# EAGLE design Sensor (EAGLE 7.2.0)
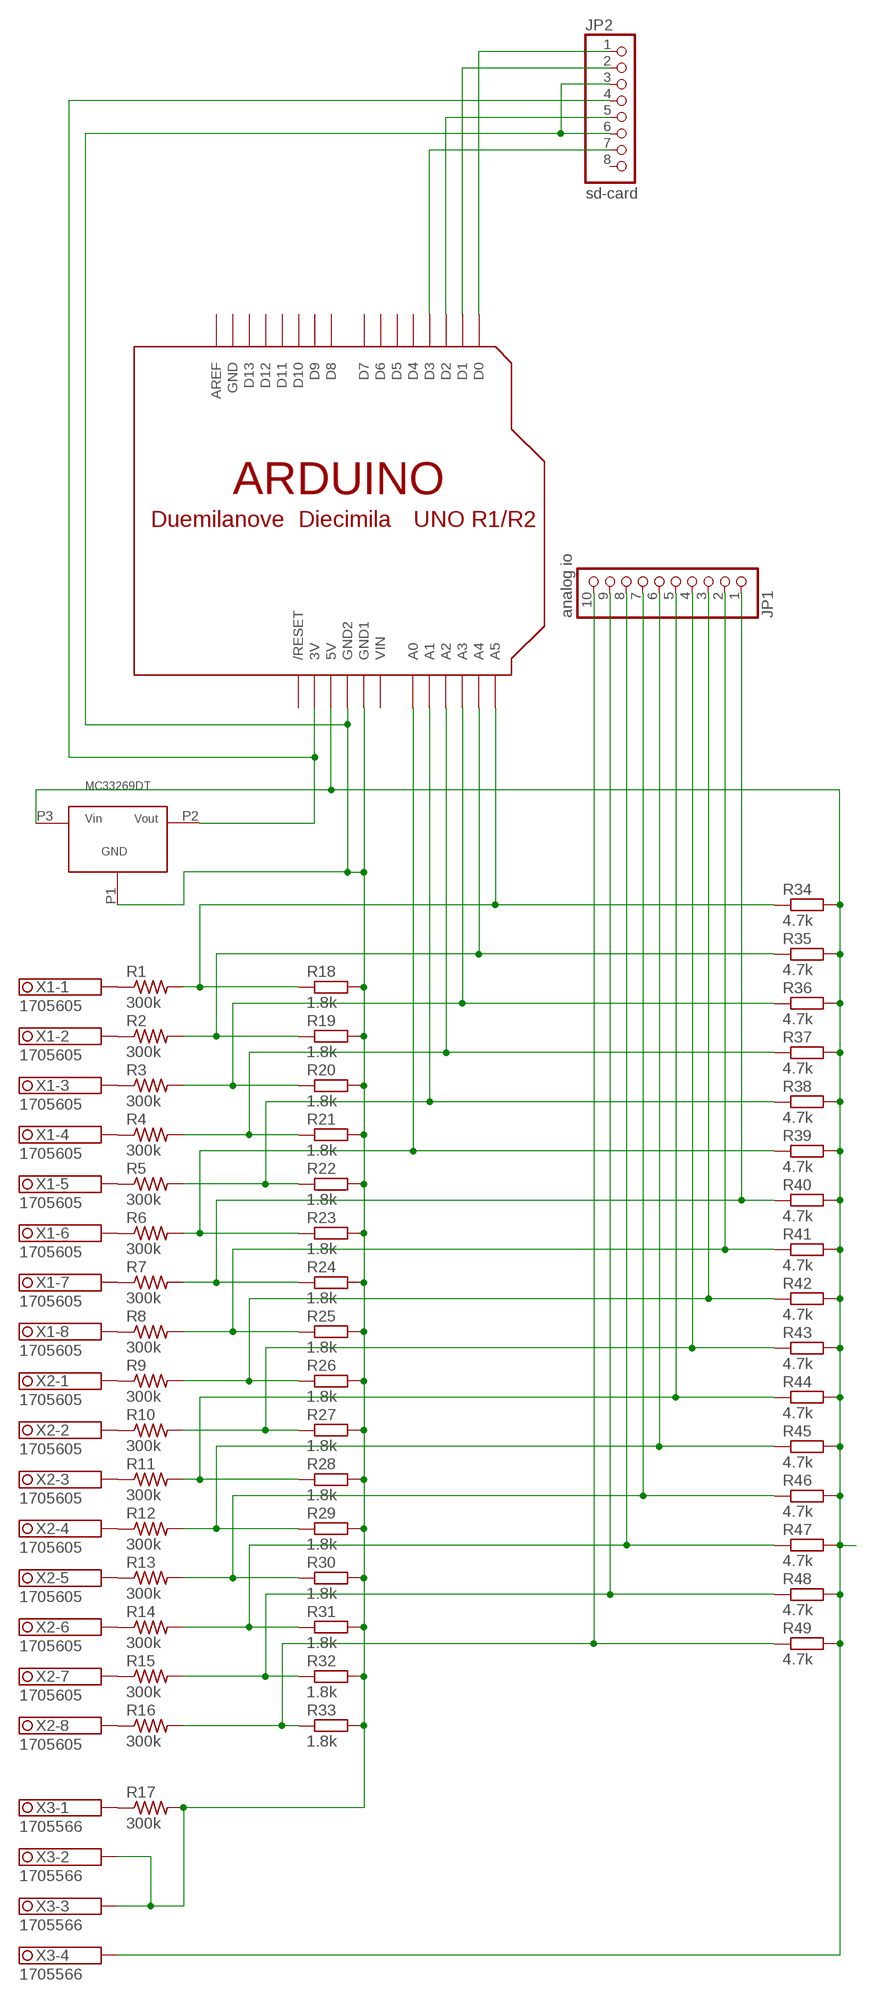
[diagram p0: schematic, sheet 1]

## Parts
JP1  analog io  PINHD-1X10  [1X10]
JP2  sd-card  PINHD-1X8  [1X08]
R1  300k  R-US_0207/15  [0207/15]
R2  300k  R-US_0207/15  [0207/15]
R3  300k  R-US_0207/15  [0207/15]
R4  300k  R-US_0207/15  [0207/15]
R5  300k  R-US_0207/15  [0207/15]
R6  300k  R-US_0207/15  [0207/15]
R7  300k  R-US_0207/15  [0207/15]
R8  300k  R-US_0207/15  [0207/15]
R9  300k  R-US_0207/15  [0207/15]
R10  300k  R-US_0207/15  [0207/15]
R11  300k  R-US_0207/15  [0207/15]
R12  300k  R-US_0207/15  [0207/15]
R13  300k  R-US_0207/15  [0207/15]
R14  300k  R-US_0207/15  [0207/15]
R15  300k  R-US_0207/15  [0207/15]
R16  300k  R-US_0207/15  [0207/15]
R17  300k  R-US_0207/15  [0207/15]
R18  1.8k  R-EU_R1206  [R1206]
R19  1.8k  R-EU_R1206  [R1206]
R20  1.8k  R-EU_R1206  [R1206]
R21  1.8k  R-EU_R1206  [R1206]
R22  1.8k  R-EU_R1206  [R1206]
R23  1.8k  R-EU_R1206  [R1206]
R24  1.8k  R-EU_R1206  [R1206]
R25  1.8k  R-EU_R1206  [R1206]
R26  1.8k  R-EU_R1206  [R1206]
R27  1.8k  R-EU_R1206  [R1206]
R28  1.8k  R-EU_R1206  [R1206]
R29  1.8k  R-EU_R1206  [R1206]
R30  1.8k  R-EU_R1206  [R1206]
R31  1.8k  R-EU_R1206  [R1206]
R32  1.8k  R-EU_R1206  [R1206]
R33  1.8k  R-EU_R1206  [R1206]
R34  4.7k  R-EU_R1206  [R1206]
R35  4.7k  R-EU_R1206  [R1206]
R36  4.7k  R-EU_R1206  [R1206]
R37  4.7k  R-EU_R1206  [R1206]
R38  4.7k  R-EU_R1206  [R1206]
R39  4.7k  R-EU_R1206  [R1206]
R40  4.7k  R-EU_R1206  [R1206]
R41  4.7k  R-EU_R1206  [R1206]
R42  4.7k  R-EU_R1206  [R1206]
R43  4.7k  R-EU_R1206  [R1206]
R44  4.7k  R-EU_R1206  [R1206]
R45  4.7k  R-EU_R1206  [R1206]
R46  4.7k  R-EU_R1206  [R1206]
R47  4.7k  R-EU_R1206  [R1206]
R48  4.7k  R-EU_R1206  [R1206]
R49  4.7k  R-EU_R1206  [R1206]
U$1  MC33269DT  [MC33269DT]
U$2  ARDUINOUNO  [ARDUINO]
X1  1705605  [1705605]
X2  1705605  [1705605]
X3  1705566  [1705566]

## Nets
N$1: R1.1 X1.1.1 X1.1.2
N$2: R2.1 X1.2.1 X1.2.2
N$3: R3.1 X1.3.1 X1.3.2
N$4: R4.1 X1.4.1 X1.4.2
N$5: R5.1 X1.5.1 X1.5.2
N$6: R6.1 X1.6.1 X1.6.2
N$7: R7.1 X1.7.1 X1.7.2
N$8: R8.1 X1.8.1 X1.8.2
N$9: R9.1 X2.1.1 X2.1.2
N$10: R10.1 X2.2.1 X2.2.2
N$11: R11.1 X2.3.1 X2.3.2
N$12: R12.1 X2.4.1 X2.4.2
N$13: R13.1 X2.5.1 X2.5.2
N$14: R14.1 X2.6.1 X2.6.2
N$15: R15.1 X2.7.1 X2.7.2
N$16: R16.1 X2.8.1 X2.8.2
N$17: R17.1 X3.1.1 X3.1.2
N$18: R1.2 R18.1 R34.1 U$2.A5
N$19: R2.2 R19.1 R35.1 U$2.A4
N$20: R3.2 R20.1 R36.1 U$2.A3
N$21: R4.2 R21.1 R37.1 U$2.A2
N$22: R5.2 R22.1 R38.1 U$2.A1
N$23: R6.2 R23.1 R39.1 U$2.A0
N$24: JP1.1 R7.2 R24.1 R40.1
N$25: JP1.2 R8.2 R25.1 R41.1
N$26: JP1.3 R9.2 R26.1 R42.1
N$27: JP1.4 R10.2 R27.1 R43.1
N$28: JP1.5 R11.2 R28.1 R44.1
N$29: JP1.6 R12.2 R29.1 R45.1
N$30: JP1.7 R13.2 R30.1 R46.1
N$31: JP1.8 R14.2 R31.1 R47.1
N$32: JP1.9 R15.2 R32.1 R48.1
N$33: JP1.10 R16.2 R33.1 R49.1
N$35: R34.2 R35.2 R36.2 R37.2 R38.2 R39.2 R40.2 R41.2 R42.2 R43.2 R44.2 R45.2 R46.2 R47.2 R48.2 R49.2 U$1.P3(VIN) U$2.5V X3.4.1 X3.4.2
N$36: JP2.1 U$2.D0
N$37: JP2.2 U$2.D1
N$38: JP2.5 U$2.D2
N$39: JP2.7 U$2.D3
N$40: JP2.4 U$1.P2(VOUT) U$2.3V
N$41: JP2.3 JP2.6 R17.2 R18.2 R19.2 R20.2 R21.2 R22.2 R23.2 R24.2 R25.2 R26.2 R27.2 R28.2 R29.2 R30.2 R31.2 R32.2 R33.2 U$1.P1(GND) U$2.GND1 U$2.GND2 X3.2.1 X3.2.2 X3.3.1 X3.3.2
Unconnected: JP2.8 U$2.AREF U$2.D4 U$2.D5 U$2.D6 U$2.D7 U$2.D8 U$2.D9 U$2.D10 U$2.D11 U$2.D12 U$2.D13 U$2.RESET(/RESET)

## Power pins joined to a net without a drawn wire
GND: U$2.GND
VIN: U$2.VIN

## Library data of the parts
JP1 = pinhead:PINHD-1X10: PIN HEADER
JP2 = pinhead:PINHD-1X8: PIN HEADER
R1-R17 = resistor:R-US_: RESISTOR, American symbol
R18-R49 = resistor:R-EU_: RESISTOR, European symbol
U$1 = mc33269dt:MC33269DT
U$2 = adafruit:ARDUINO: Arduino Diecimila/Duemilanove Make a shield with ease, this package has all the named pins as well as the two mounting drill holes and an outline of the USB and DC power connector. The outline is on the DIMENSION layer, so if your board house uses it they will cut the outline to match. http://www.ladyada.net/library/pcb/eaglelibrary.html
X1 X2 = con-phoenix-3.81:1705605: MKDSD 1,5/10-3,81 Printklemme Nennstrom: 8 A Bemessungsspannung: 200 V Raster: 3,81 mm Polzahl: 12 Montageart: Löten Anschlussart: Schraubanschluss Anschlussrichtung vom Leiter zur Platine: 0° Source: http://eshop.phoenixcontact.com .. 1705605.pdf; OC_FARNELL: unknown; OC_NEWARK: unknown
X3 = con-phoenix-3.81:1705566: MKDSD 1,5/ 4-3,81 Printklemme Nennstrom: 8 A Bemessungsspannung: 200 V Raster: 3,81 mm Polzahl: 4 Montageart: Löten Anschlussart: Schraubanschluss Anschlussrichtung vom Leiter zur Platine: 0° Source: http://eshop.phoenixcontact.com .. 1705566.pdf; OC_FARNELL: unknown; OC_NEWARK: unknown

## Net classes
0 default: width 2.032 mm, clearance 0.205 mm

## Board
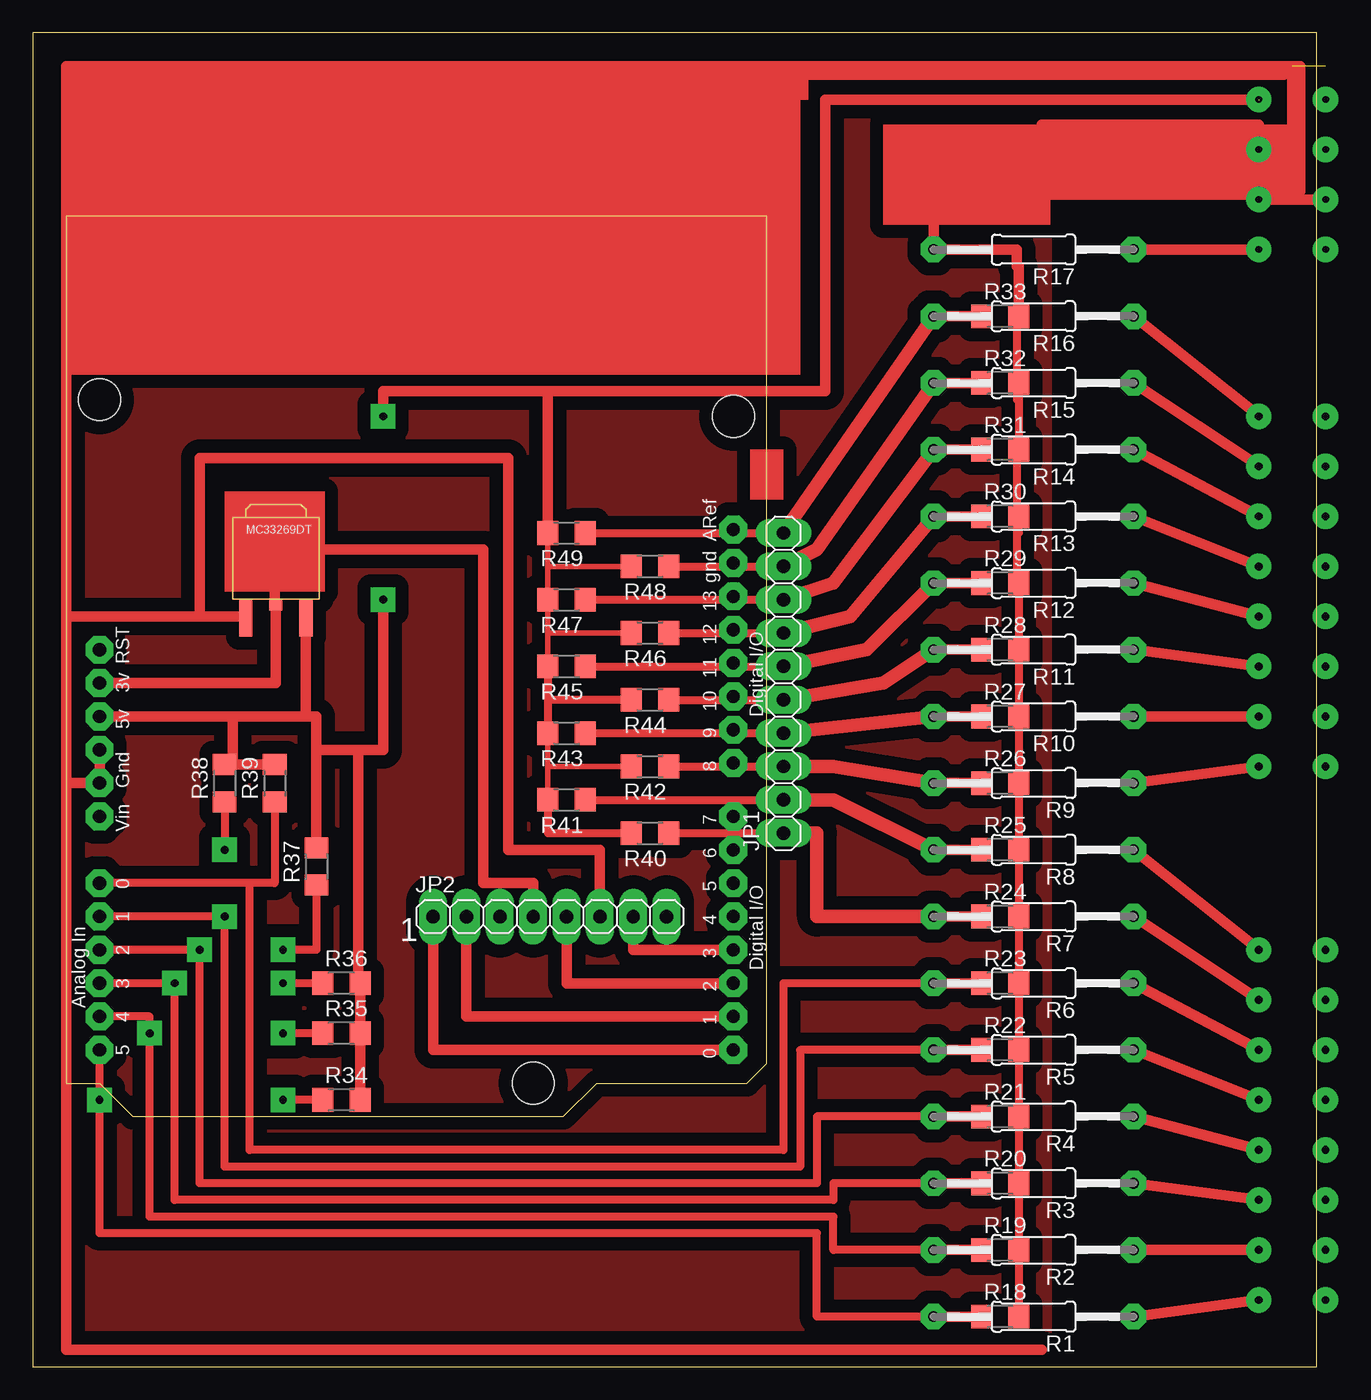
[diagram p1: board, top side]
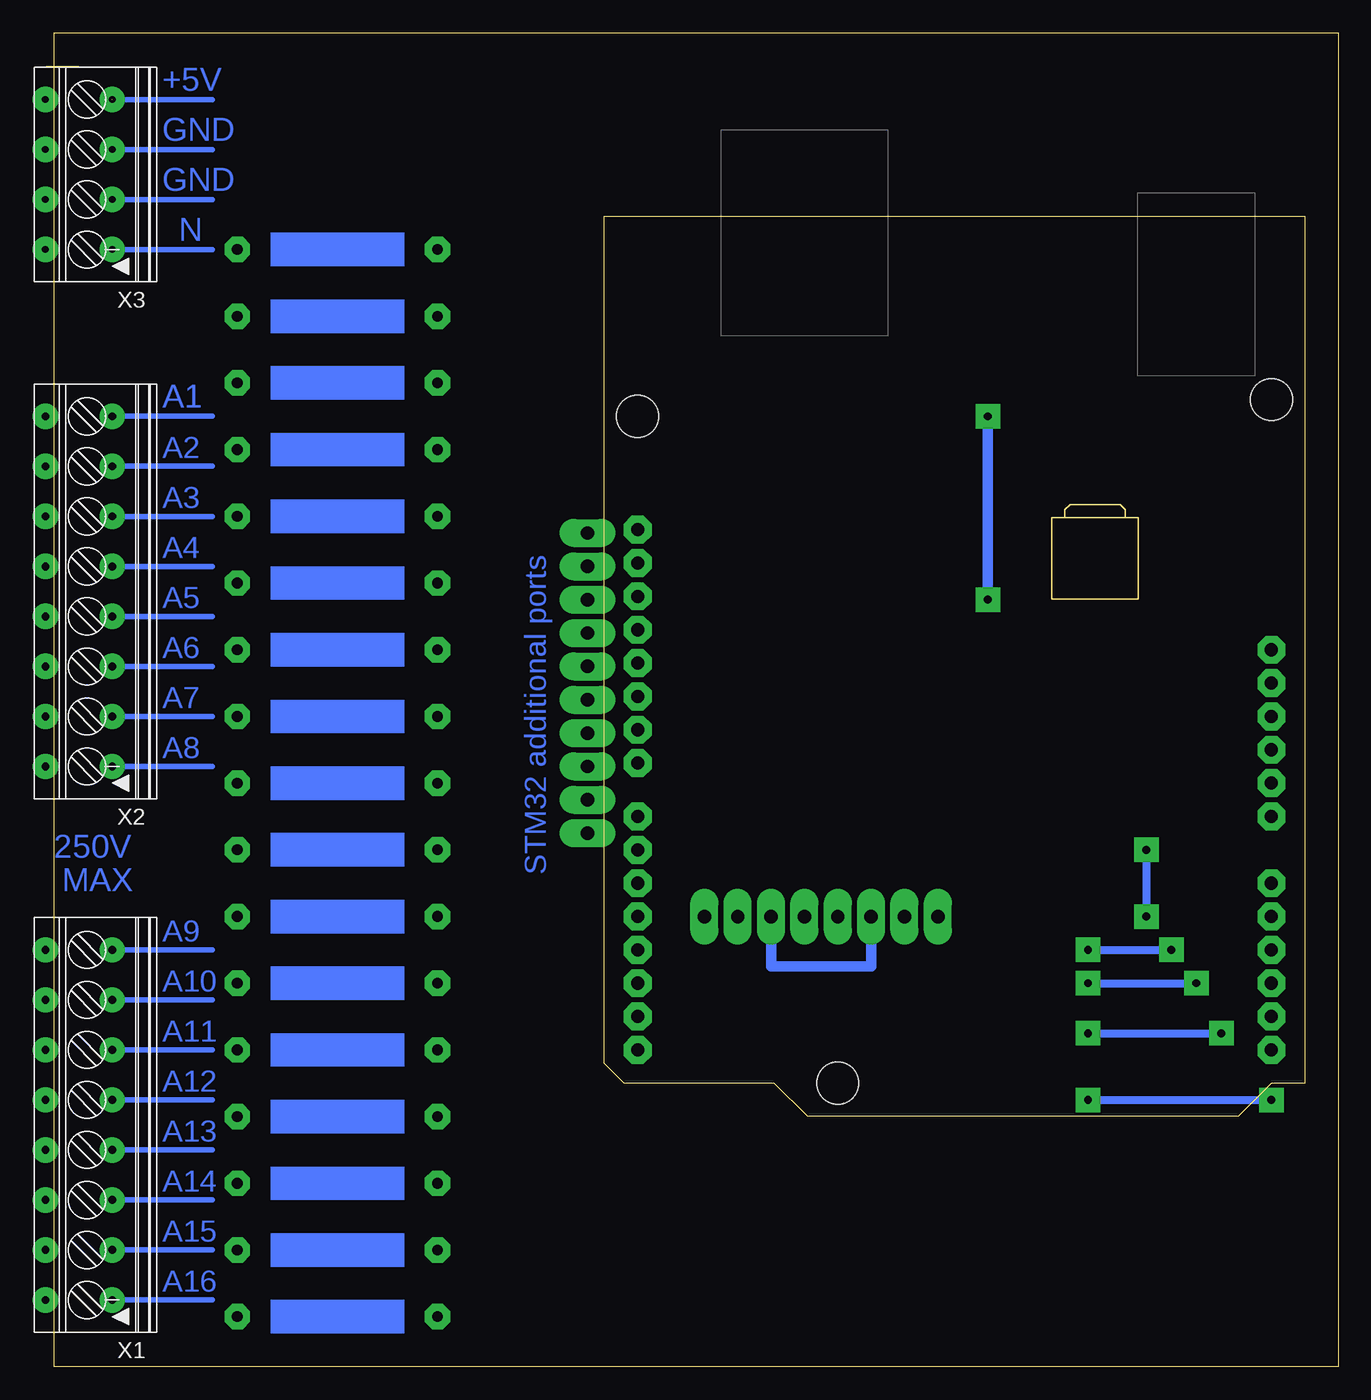
[diagram p2: board, bottom side, seen from below]

Size 97.77 x 101.6 mm. Coordinates in mm from the lower left corner, seen from the top.
Outline: 0,0 97.77,0 97.77,101.6 0,101.6 0,0
Copper layers (1*16): Top 0.035mm / dielectric 1.5mm / Bottom 0.035mm
Design rules "default *": minimum track width 10mil, minimum drill 10mil, track to track 8mil, track to pad 8mil, pad to pad 8mil, via to via 8mil, smd to smd 8mil, copper to edge 40mil, drill to drill 8mil, minimum pad ring 22mil, minimum via ring 25mil, stop-mask expansion 4mil, vias tented up to drill 0mil, thermal gap 10mil

### Footprints (pad centres in the part's own frame; a part is rotated, then mirrored left to right if it is on the bottom)
1X10 = drill 1.016 long: 1 -11.43,0; 2 -8.89,0; 3 -6.35,0; 4 -3.81,0; 5 -1.27,0; 6 1.27,0; 7 3.81,0; 8 6.35,0; 9 8.89,0; 10 11.43,0
1X08 = drill 1.016 long: 1 -8.89,0; 2 -6.35,0; 3 -3.81,0; 4 -1.27,0; 5 1.27,0; 6 3.81,0; 7 6.35,0; 8 8.89,0
0207/15 = drill 0.813 octagon: 1 -7.62,0; 2 7.62,0
R1206 = smd 1.6 x 1.803: 1 -1.422,0; 2 1.422,0
MC33269DT = smd 1 x 2.8: P1 -2.2,-4.59; P3 2.38,-4.59 | smd 1 x 0.8: P2 0.09,-3.59
ARDUINO = drill 1 pad 1.676 octagon: 3V 35.56,2.54; 5V 38.1,2.54; A0 50.8,2.54; A1 53.34,2.54; A2 55.88,2.54; A3 58.42,2.54; A4 60.96,2.54; A5 63.5,2.54; AREF 23.876,50.8; D0 63.5,50.8; D1 60.96,50.8; D2 58.42,50.8; D3 55.88,50.8; D4 53.34,50.8; D5 50.8,50.8; D6 48.26,50.8; D7 45.72,50.8; D8 41.656,50.8; D9 39.116,50.8; D10 36.576,50.8; D11 34.036,50.8; D12 31.496,50.8; D13 28.956,50.8; GND 26.416,50.8; GND1 43.18,2.54; GND2 40.64,2.54; RESET 33.02,2.54; VIN 45.72,2.54 | hole 3.2: 15.24,50.8; 66.04,35.56; 13.97,2.54
1705605 = drill 0.5 pad 0.9: 1.1 -13.335,-1.25; 1.2 -13.335,3.83; 2.1 -9.525,-1.25; 2.2 -9.525,3.83; 3.1 -5.715,-1.25; 3.2 -5.715,3.83; 4.1 -1.905,-1.25; 4.2 -1.905,3.83; 5.1 1.905,-1.25; 5.2 1.905,3.83; 6.1 5.715,-1.25; 6.2 5.715,3.83; 7.1 9.525,-1.25; 7.2 9.525,3.83; 8.1 13.335,-1.25; 8.2 13.335,3.83
1705566 = drill 0.5 pad 0.9: 1.1 -5.715,-1.25; 1.2 -5.715,3.83; 2.1 -1.905,-1.25; 2.2 -1.905,3.83; 3.1 1.905,-1.25; 3.2 1.905,3.83; 4.1 5.715,-1.25; 4.2 5.715,3.83

### Placement (x,y rotation side)
JP1  57.15,52.07 90 top
JP2  39.37,34.29 0 top
R1  76.2,3.81 180 top
R2  76.2,8.89 180 top
R3  76.2,13.97 180 top
R4  76.2,19.05 180 top
R5  76.2,24.13 180 top
R6  76.2,29.21 180 top
R7  76.2,34.29 180 top
R8  76.2,39.37 180 top
R9  76.2,44.45 180 top
R10  76.2,49.53 180 top
R11  76.2,54.61 180 top
R12  76.2,59.69 180 top
R13  76.2,64.77 180 top
R14  76.2,69.85 180 top
R15  76.2,74.93 180 top
R16  76.2,80.01 180 top
R17  76.2,85.09 180 top
R18  73.66,3.81 0 top
R19  73.66,8.89 0 top
R20  73.66,13.97 0 top
R21  73.66,19.05 0 top
R22  73.66,24.13 0 top
R23  73.66,29.21 0 top
R24  73.66,34.29 0 top
R25  73.66,39.37 0 top
R26  73.66,44.45 0 top
R27  73.66,49.53 0 top
R28  73.66,54.61 0 top
R29  73.66,59.69 0 top
R30  73.66,64.77 0 top
R31  73.66,69.85 0 top
R32  73.66,74.93 0 top
R33  73.66,80.01 0 top
R34  23.5,20.32 0 top
R35  23.5,25.4 0 top
R36  23.5,29.21 0 top
R37  21.59,38.1 90 top
R38  14.61,44.45 90 top
R39  18.41,44.45 90 top
R40  46.99,40.64 180 top
R41  40.64,43.18 180 top
R42  46.99,45.72 180 top
R43  40.64,48.26 180 top
R44  46.99,50.8 180 top
R45  40.64,53.34 180 top
R46  46.99,55.88 180 top
R47  40.64,58.42 180 top
R48  46.99,60.96 180 top
R49  40.64,63.5 180 top
U$1  18.41,61.59 0 top
U$2  2.54,87.63 270 top
X1  94.61,18.41 90 bottom
X2  94.61,59.05 90 bottom
X3  94.61,90.81 90 bottom

### Tracks (layer width: path | path; a pad name or v marks a point on that pad's centre or on a via)
N$1
  Top 0.813: R1.1 X1.1.1
N$2  (via drill 0.6 pad 1.93)
  Top 0.813: R2.1 v93.34,8.89 X1.2.1
  Bottom 0.406: v93.34,8.89 85.72,8.89
N$3
  Top 0.813: R3.1 X1.3.1
N$4
  Top 0.813: R4.1 X1.4.1
N$5
  Top 0.813: R5.1 X1.5.1
N$6
  Top 0.813: R6.1 X1.6.1
N$7
  Top 0.813: R7.1 X1.7.1
N$8
  Top 0.813: R8.1 X1.8.1
N$9
  Top 0.813: R9.1 X2.1.1
N$10  (via drill 0.6 pad 1.93)
  Top 0.813: R10.1 v93.34,49.53 X2.2.1
  Bottom 0.406: v93.34,49.53 85.72,49.53
N$11
  Top 0.813: R11.1 X2.3.1
N$12
  Top 0.813: R12.1 X2.4.1
N$13
  Top 0.813: R13.1 X2.5.1
N$14
  Top 0.813: R14.1 X2.6.1
N$15
  Top 0.813: R15.1 X2.7.1
N$16
  Top 0.813: R16.1 X2.8.1
N$17  (via drill 0.5 pad 1.93)
  Top 0.813: R17.1 v93.34,85.09 X3.1.1
  Bottom 0.406: v93.34,85.09 85.72,85.09
N$18  (via drill 0.6)
  Top 0.61: R1.2 59.69,3.81 59.69,10.16 5.08,10.16 v5.08,20.32 U$2.A5 | R34.1 v19.05,20.32
  Top 0.813: R1.2 R18.1
  Bottom 0.61: v19.05,20.32 v5.08,20.32
N$19  (via drill 0.6)
  Top 0.61: R2.2 60.96,8.89 60.96,11.43 8.89,11.43 v8.89,25.4 8.89,26.67 U$2.A4 | R35.1 v19.05,25.4
  Top 0.813: R2.2 R19.1
  Bottom 0.61: v19.05,25.4 v8.89,25.4
N$20  (via drill 0.6)
  Top 0.61: R3.2 60.96,13.97 60.96,12.7 10.79,12.7 v10.79,29.21 U$2.A3 | R36.1 v19.05,29.21
  Top 0.813: R3.2 R20.1
  Bottom 0.61: v19.05,29.21 v10.79,29.21
N$21  (via drill 0.6)
  Top 0.61: R4.2 59.69,19.05 59.69,13.97 12.7,13.97 v12.7,31.75 U$2.A2 | R37.1 21.59,31.75 v19.05,31.75
  Top 0.813: R4.2 R21.1
  Bottom 0.61: v19.05,31.75 v12.7,31.75
N$22  (via drill 0.6)
  Top 0.61: R5.2 58.42,24.13 58.42,15.24 14.61,15.24 v14.61,34.29 U$2.A1 | R38.1 v14.61,39.37
  Top 0.813: R5.2 R22.1
  Bottom 0.61: v14.61,39.37 v14.61,34.29
N$23
  Top 0.61: R6.2 57.15,29.21 57.15,16.51 16.51,16.51 16.51,36.83 | 16.51,36.83 U$2.A0 | R39.1 18.41,36.83 16.51,36.83
  Top 0.813: R6.2 R23.1
N$24
  Top 0.61: R40.1 JP1.1
  Top 0.813: R7.2 R24.1
  Top 1.016: R7.2 59.69,34.29 59.69,40.64 JP1.1
N$25
  Top 0.61: R41.1 JP1.2
  Top 0.813: R8.2 R25.1
  Top 1.016: R8.2 60.96,43.18 JP1.2
N$26
  Top 0.61: R42.1 JP1.3
  Top 0.813: R9.2 R26.1
  Top 1.016: R9.2 60.96,45.72 JP1.3
N$27
  Top 0.61: R43.1 JP1.4
  Top 0.813: R10.2 R27.1
  Top 1.016: R10.2 JP1.4
N$28
  Top 0.61: R44.1 JP1.5
  Top 0.813: R11.2 R28.1
  Top 1.016: R11.2 64.77,52.07 JP1.5
N$29
  Top 0.61: R45.1 JP1.6
  Top 0.813: R12.2 R29.1
  Top 1.016: R12.2 63.5,54.61 JP1.6
N$30
  Top 0.61: R46.1 JP1.7
  Top 0.813: R13.2 R30.1
  Top 1.016: R13.2 62.23,57.15 JP1.7
N$31
  Top 0.61: R47.1 JP1.8
  Top 0.813: R14.2 R31.1
  Top 1.016: R14.2 60.96,59.69 JP1.8
N$32
  Top 0.61: R48.1 JP1.9
  Top 0.813: R15.2 R32.1
  Top 1.016: R15.2 59.69,62.23 JP1.9
N$33
  Top 0.61: R49.1 JP1.10
  Top 0.813: R16.2 R33.1
  Top 1.016: R16.2 JP1.10
N$34  (via drill 0.6 pad 1.93)
  Bottom 0.406: v93.34,72.39 85.72,72.39
N$35  (via drill 0.5 pad 1.93, 0.6)  (1 unrouted)
  Top 0.406: R49.2 39.22,60.96 | 39.22,60.96 R47.2 39.22,55.88 | 39.22,55.88 R45.2 | R43.2 39.22,45.72 | 39.22,45.72 R41.2 | R42.2 39.22,45.72 | R46.2 39.22,55.88 | 45.72,60.96 R48.2 39.22,60.96
  Top 0.61: R45.2 39.22,50.8 | 39.22,50.8 R43.2 | R44.2 39.22,50.8 | R41.2 39.22,40.64 R40.2
  Top 0.813: R38.2 15.24,45.87 | 15.24,45.87 R39.2 | U$2.5V 15.24,49.53 | 15.24,49.53 15.24,45.87 | U$1.P3 20.8,49.53 | 20.8,49.53 15.24,49.53 | v93.34,96.52 60.33,96.52 60.33,74.3 39.22,74.3 | 39.22,74.3 R49.2 | R37.2 21.59,46.99 | 21.59,46.99 24.77,46.99 | 24.77,46.99 26.67,46.99 v26.67,58.42 | v26.67,72.39 26.67,74.3 39.22,74.3 | 20.8,49.53 21.59,49.53 21.59,46.99 | R34.2 R35.2 R36.2 24.77,29.21 24.77,46.99
  Bottom 0.406: v93.34,96.52 85.72,96.52
  Bottom 0.813: v26.67,58.42 v26.67,72.39
N$36
  Top 0.813: JP2.1 30.48,24.13 U$2.D0
N$37
  Top 0.813: JP2.2 33.02,26.67 U$2.D1
N$38
  Top 0.813: JP2.5 40.64,29.21 U$2.D2
N$39
  Top 0.813: JP2.7 45.72,31.75 U$2.D3
N$40
  Top 0.813: U$2.3V 18.5,52.07 U$1.P2 18.41,58.01 18.41,62.23 34.29,62.23 34.29,36.83 38.1,36.83 JP2.4
N$41  (via drill 0.5 pad 1.93)  (1 unrouted)
  Top 0.61: R33.2 74.93,80.01 74.93,73.66 75.08,73.66 R32.2 R31.2 74.93,69.85 74.93,63.5 75.08,63.5 R30.2 74.93,64.77 74.93,59.69 R29.2 R28.2 R27.2 R26.2 R25.2 R24.2 R23.2 R22.2 R21.2 R20.2 R19.2 R18.2
  Top 0.813: R33.2 75.08,83.82 74.93,83.82 74.93,85.09 R17.2 68.58,92.71 v93.34,92.71 X3.3.1 X3.2.1 | X3.2.2 v98.42,88.9 95.89,88.9 | 95.89,88.9 X3.2.1 | v93.34,88.9 X3.2.1 | U$2.GND2 U$2.GND1 2.54,44.45 | 2.54,44.45 2.54,57.15 | 2.54,57.15 2.54,99.06 95.89,99.06 | 95.89,99.06 95.89,88.9 | U$1.P1 16.21,57.15 12.7,57.15 | 12.7,57.15 2.54,57.15 | JP2.6 43.18,39.37 36.2,39.37 36.2,69.22 12.7,69.22 12.7,57.15 | 2.54,44.45 2.54,1.27 76.83,1.27 | 95.89,99.06 96.52,99.06 96.52,89.53
  Bottom 0.406: v93.34,92.71 85.72,92.71 | v93.34,88.9 85.72,88.9
  Bottom 0.813: JP2.6 43.18,30.48 35.56,30.48 JP2.3
N$42  (via drill 0.6 pad 1.93)
  Bottom 0.406: v93.34,68.58 85.72,68.58
N$43  (via drill 0.6 pad 1.93)
  Bottom 0.406: v93.34,64.77 85.72,64.77
N$44  (via drill 0.6 pad 1.93)
  Bottom 0.406: v93.34,60.96 85.72,60.96
N$45  (via drill 0.6 pad 1.93)
  Bottom 0.406: v93.34,57.15 85.72,57.15
N$46  (via drill 0.6 pad 1.93)
  Bottom 0.406: v93.34,53.34 85.72,53.34
N$47  (via drill 0.6 pad 1.93)
  Bottom 0.406: v93.34,45.72 85.72,45.72
N$48  (via drill 0.6 pad 1.93)
  other vias: 98.42,72.39
N$49  (via drill 0.6 pad 1.93)
  other vias: 98.42,68.58
N$50  (via drill 0.6 pad 1.93)
  other vias: 98.42,64.77
N$51  (via drill 0.6 pad 1.93)
  other vias: 98.42,60.96
N$52  (via drill 0.6 pad 1.93)
  other vias: 98.42,57.15
N$53  (via drill 0.6 pad 1.93)
  other vias: 98.42,53.34
N$54  (via drill 0.6 pad 1.93)
  other vias: 98.42,49.53
N$55  (via drill 0.6 pad 1.93)
  other vias: 98.42,45.72
N$56  (via drill 0.6 pad 1.93)
  Bottom 0.406: v93.34,31.75 85.72,31.75
N$57  (via drill 0.6 pad 1.93)
  Bottom 0.406: v93.34,27.94 85.72,27.94
N$58  (via drill 0.6 pad 1.93)
  Bottom 0.406: v93.34,24.13 85.72,24.13
N$59  (via drill 0.6 pad 1.93)
  Bottom 0.406: v93.34,20.32 85.72,20.32
N$60  (via drill 0.6 pad 1.93)
  Bottom 0.406: v93.34,16.51 85.72,16.51
N$61  (via drill 0.6 pad 1.93)
  Bottom 0.406: v93.34,12.7 85.72,12.7
N$62  (via drill 0.6 pad 1.93)
  Bottom 0.406: v93.34,5.08 85.72,5.08
N$63  (via drill 0.6 pad 1.93)
  other vias: 98.42,5.08
N$64  (via drill 0.6 pad 1.93)
  other vias: 98.42,8.89
N$65  (via drill 0.6 pad 1.93)
  other vias: 98.42,12.7
N$66  (via drill 0.6 pad 1.93)
  other vias: 98.42,16.51
N$67  (via drill 0.6 pad 1.93)
  other vias: 98.42,20.32
N$68  (via drill 0.6 pad 1.93)
  other vias: 98.42,24.13
N$69  (via drill 0.6 pad 1.93)
  other vias: 98.42,27.94
N$70  (via drill 0.6 pad 1.93)
  other vias: 98.42,31.75
N$71  (via drill 0.5 pad 1.93)
  other vias: 98.42,85.09
N$72  (via drill 0.5 pad 1.93)
  other vias: 98.42,92.71
N$73  (via drill 0.5 pad 1.93)
  other vias: 98.42,96.52
N$74
  pour Top (isolate 1.016, rank 6, no thermals): 2.54,99.06 77.47,99.06 77.47,0 2.54,0
N$75
  Top 0.813: 58.42,98.42 95.25,98.42
N$76
  Top 0.813: 76.83,94.61 93.34,94.61
(copper drawn outside any net)
  shapes: Bottom area x17, Top area x12

### Text on the board
Bottom: +5V | GND | GND | N | A1 | A2 | A3 | A4 | A5 | A6 | A7 | A8 | 250V | STM32 additional ports | MAX | A9 | A10 | A11 | A12 | A13 | A14 | A15 | A16
tNames: 1